# EAGLE schematic MRCS-Remote-Switch-Motor-Controller (EAGLE 7.7.0)
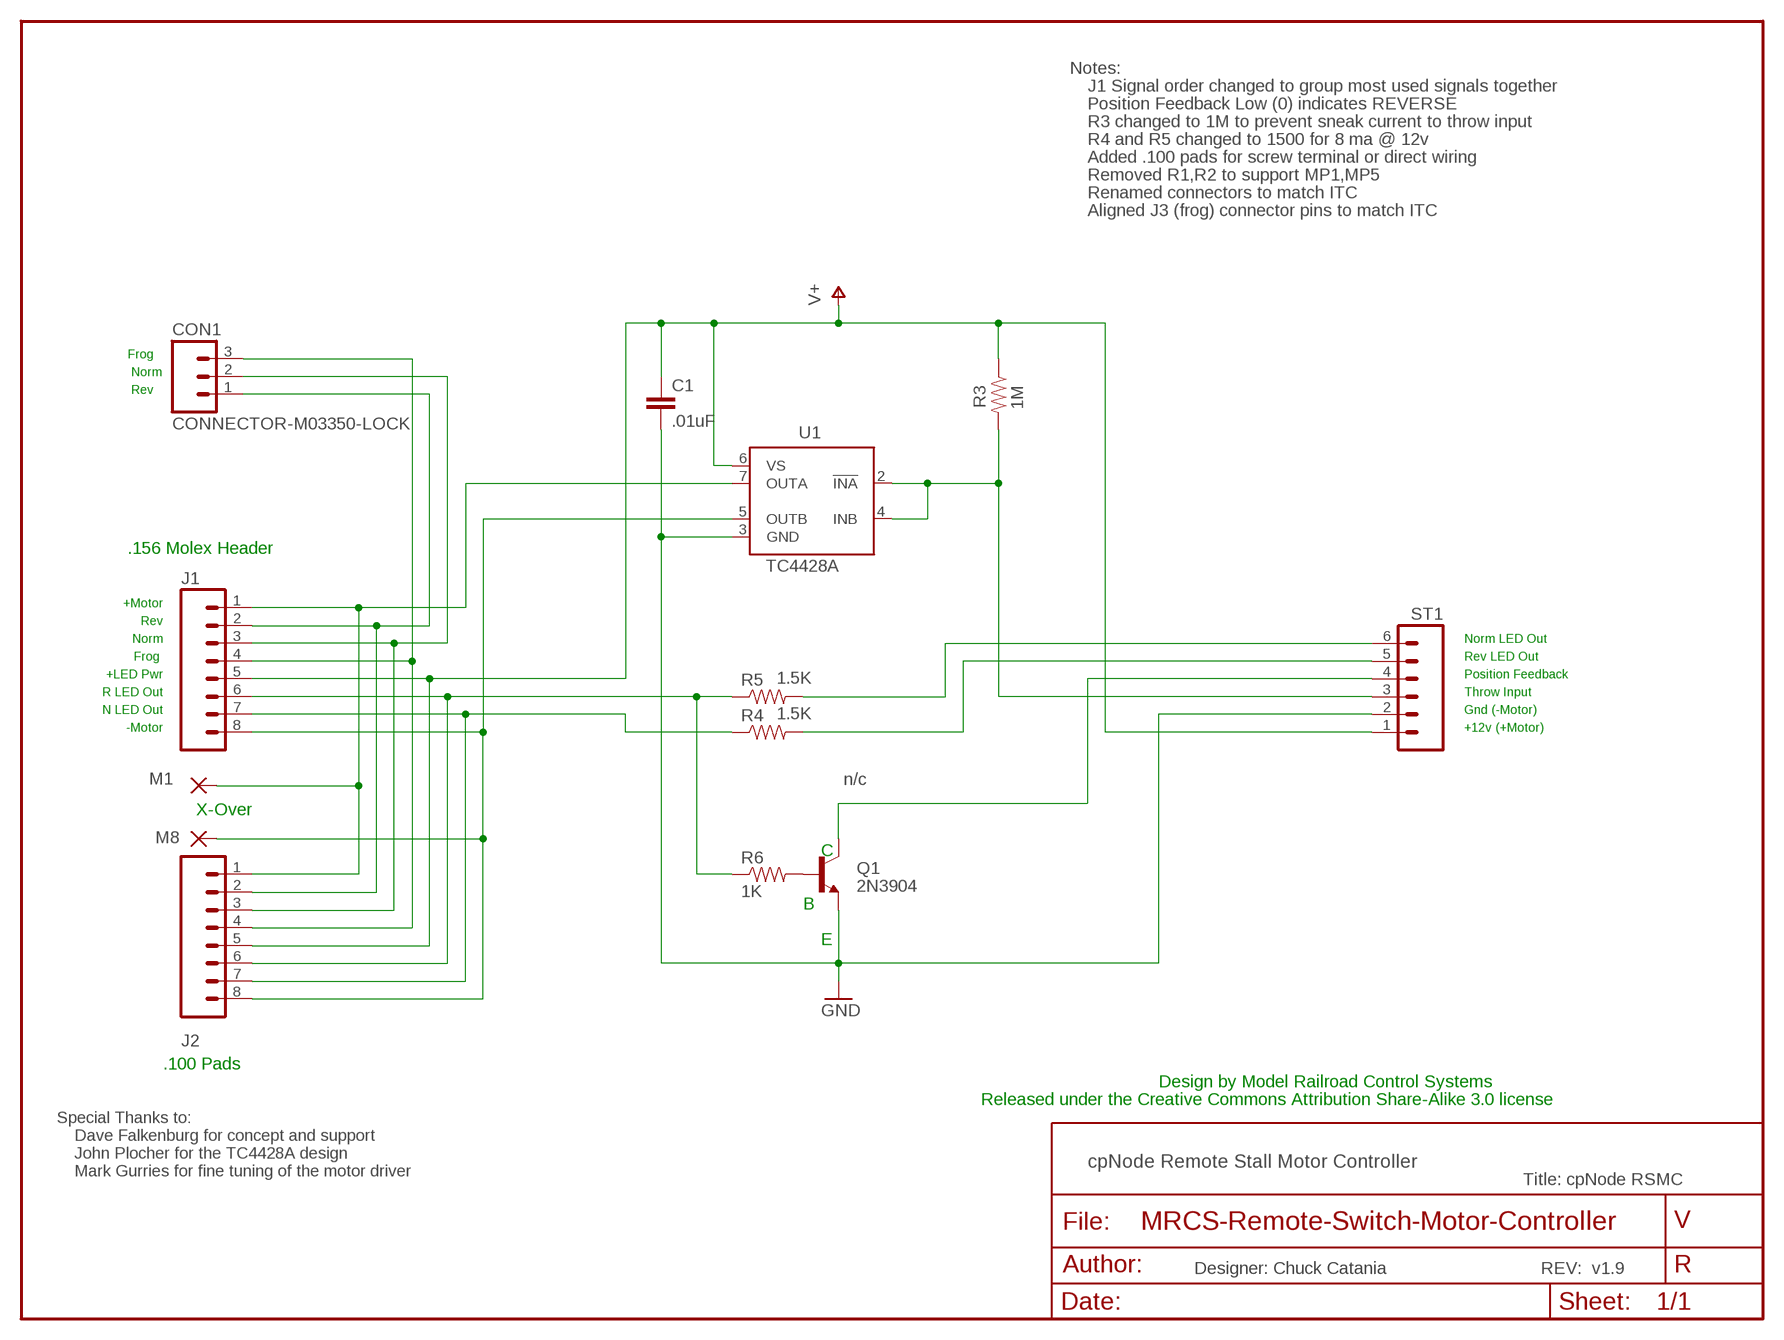
[diagram p0: schematic, sheet 1]

## Parts
C1  .01uF  CAPEZ  [CAP-PTH-SMALLEZ]
CON1  CONNECTOR-M03350-LOCK  [1751251]
J1  J1  CONNECTOR-M081.56-F  [KK-156-8-F]
J2  J2  M08  [1X08_PIN1_NO_SILK]
M1  WIREPAD2,54/1,1  [2,54/1,1]
M8  WIREPAD2,54/1,1  [2,54/1,1]
Q1  2N3904  NPN-MS-013  [TO-92-MS013]
R3  1M  RPTH04  [AXIAL-0.4-RES]
R4  1.5K  RPTH04  [AXIAL-0.4-RES]
R5  1.5K  RPTH04  [AXIAL-0.4-RES]
R6  1K  RPTH04  [AXIAL-0.4-RES]
ST1  M06LOCK  [1X06_LOCK]
U1  TC4428A  IR4428  [DIL08]

## Nets
FROG: CON1.3 J1.4 J2.4
GND: C1.2 Q1.1(E) ST1.2 U1.3(GND)
M+: J1.1 J2.1 M1.1(P) U1.7(OUTA)
M-: J1.8 J2.8 M8.1(P) U1.5(OUTB)
N$3: Q1.3(C) ST1.4
N$4: R4.P$2 ST1.5
N$8: Q1.2(B) R6.P$2
N$9: R5.P$2 ST1.6
N$14: R3.P$2 ST1.3 U1.2(!INA) U1.4(INB)
N-LED: J1.7 J2.7 R4.P$1
NORM: CON1.2 J1.3 J2.3
R-LED: J1.6 J2.6 R5.P$1 R6.P$1
REV: CON1.1 J1.2 J2.2
V+: C1.1 J1.5 J2.5 R3.P$1 ST1.1 U1.6(VS)

## Notes on the sheet
- Notes:
- J1 Signal order changed to group most used signals together
- Position Feedback Low (0) indicates REVERSE
- R3 changed to 1M to prevent sneak current to throw input
- R4 and R5 changed to 1500 for 8 ma @ 12v
- Added .100 pads for screw terminal or direct wiring
- Removed R1,R2 to support MP1,MP5
- Renamed connectors to match ITC
- Aligned J3 (frog) connector pins to match ITC
- Frog
- Norm
- Rev
- .156 Molex Header
- +Motor
- Rev
- Norm | Norm LED Out
- Frog | Rev LED Out
- +LED Pwr | Position Feedback
- R LED Out | Throw Input
- N LED Out | Gnd (-Motor)
- -Motor | +12v (+Motor)
- n/c
- X-Over
- C
- B
- E
- .100 Pads
- Design by Model Railroad Control Systems
- Released under the Creative Commons Attribution Share-Alike 3.0 license
- Special Thanks to:
- Dave Falkenburg for concept and support
- John Plocher for the TC4428A design
- cpNode Remote Stall Motor Controller
- Mark Gurries for fine tuning of the motor driver
- Title: cpNode RSMC
- Designer: Chuck Catania | REV:  v1.9

## Library data of the parts
C1 = SparkFun-Passives:CAP: Capacitor Standard 0603 ceramic capacitor, and 0.1" leaded capacitor.
CON1 = SPCoast:CONNECTOR-M03
J1 = SPCoast:CONNECTOR-M08: Header 8 Standard 8-pin 0.1" header. Use with straight break away headers (SKU : PRT-00116), right angle break away headers (PRT-00553), swiss pins (PRT-00743), machine pins (PRT-00117), and female headers (PRT-00115).
J2 = SparkFun-Connectors:M08: Header 8 Standard 8-pin 0.1" header. Use with straight break away headers (SKU : PRT-00116), right angle break away headers (PRT-00553), swiss pins (PRT-00743), machine pins (PRT-00117), and female headers (PRT-00115).
M1 M8 = wirepad:WIREPAD: Wire PAD connect wire on PCB
Q1 = SPCoast:NPN: Transistor NPN BJT configuration in SOT23 package. MMBT2222 is the common NPN we use. Double check BCE configuration again layout.
R3-R6 = SPCoast:R*: Resistor Basic schematic elements and footprints for 0603, 1206, and PTH 1/10th watt (small) resistors.
ST1 = SparkFun-Connectors:M06: Header 6 Standard 6-pin 0.1" header. Use with straight break away headers (SKU : PRT-00116), right angle break away headers (PRT-00553), swiss pins (PRT-00743), machine pins (PRT-00117), and female headers (PRT-00115). Molex polarized connector foot print use with SKU : PRT-08094 with associated crimp pins and housings. NOTES ON THE VARIANTS LOCK and LOCK_LONGPADS... This footprint was designed to help hold the alignment of a through-hole component (i.e. 6-pin header) while soldering it into place. You may notice that each hole has been shifted either up or down by 0.005 of an inch from it's more standard position (which is a perfectly straight line). This slight alteration caused the pins (the squares in the middle) to touch the edges of the holes. Because they are alternating, it causes a "brace" to hold the component in place. 0.005 has proven to be the perfect amount of "off-center" position when using our standard breakaway headers. Although looks a little odd when you look at the bare footprint, once you have a header in there, the alteration is very hard to notice. Also,if you push a header all the way into place, it is covered up entirely on the bottom side. This idea of altering the position of holes to aid alignment will be further integrated into the Sparkfun Library for other footprints. It can help hold any component with 3 or more connection pins.
U1 = ir:IR4428: DUAL LOW SIDE DRIVER Source: ID4426.pdf; MF: INTERNATIONAL RECTIFIER(IR); MPN: IR4428PBF; OC_FARNELL: 1023268; OC_NEWARK: 19K8464